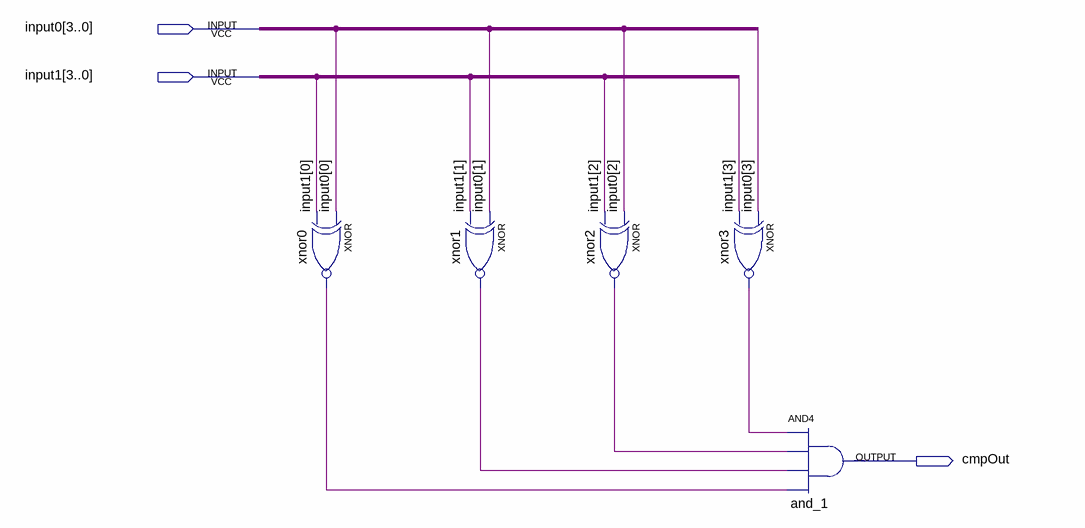
[diagram p0: schematic sheet]
// Quartus schematic EqCmp4.bdf as structural Verilog: 5 symbols, 3 pins
module EqCmp4 (
  input  [3:0] input0,
  input  [3:0] input1,
  output cmpOut
);

  wire xnor0_out, xnor1_out, xnor2_out, xnor3_out;

  xnor xnor0 (xnor0_out, input0[0], input1[0]);
  xnor xnor1 (xnor1_out, input0[1], input1[1]);
  xnor xnor2 (xnor2_out, input0[2], input1[2]);
  xnor xnor3 (xnor3_out, input0[3], input1[3]);
  and and_1 (cmpOut, xnor3_out, xnor2_out, xnor1_out, xnor0_out);
endmodule
